# Altium project ECU V1.0 B.PrjPcb (part 8 of 9)

## Sheet 21_GPIOs_EXP.SchDoc
size A3; SheetNumber: 22; SheetTotal: 22
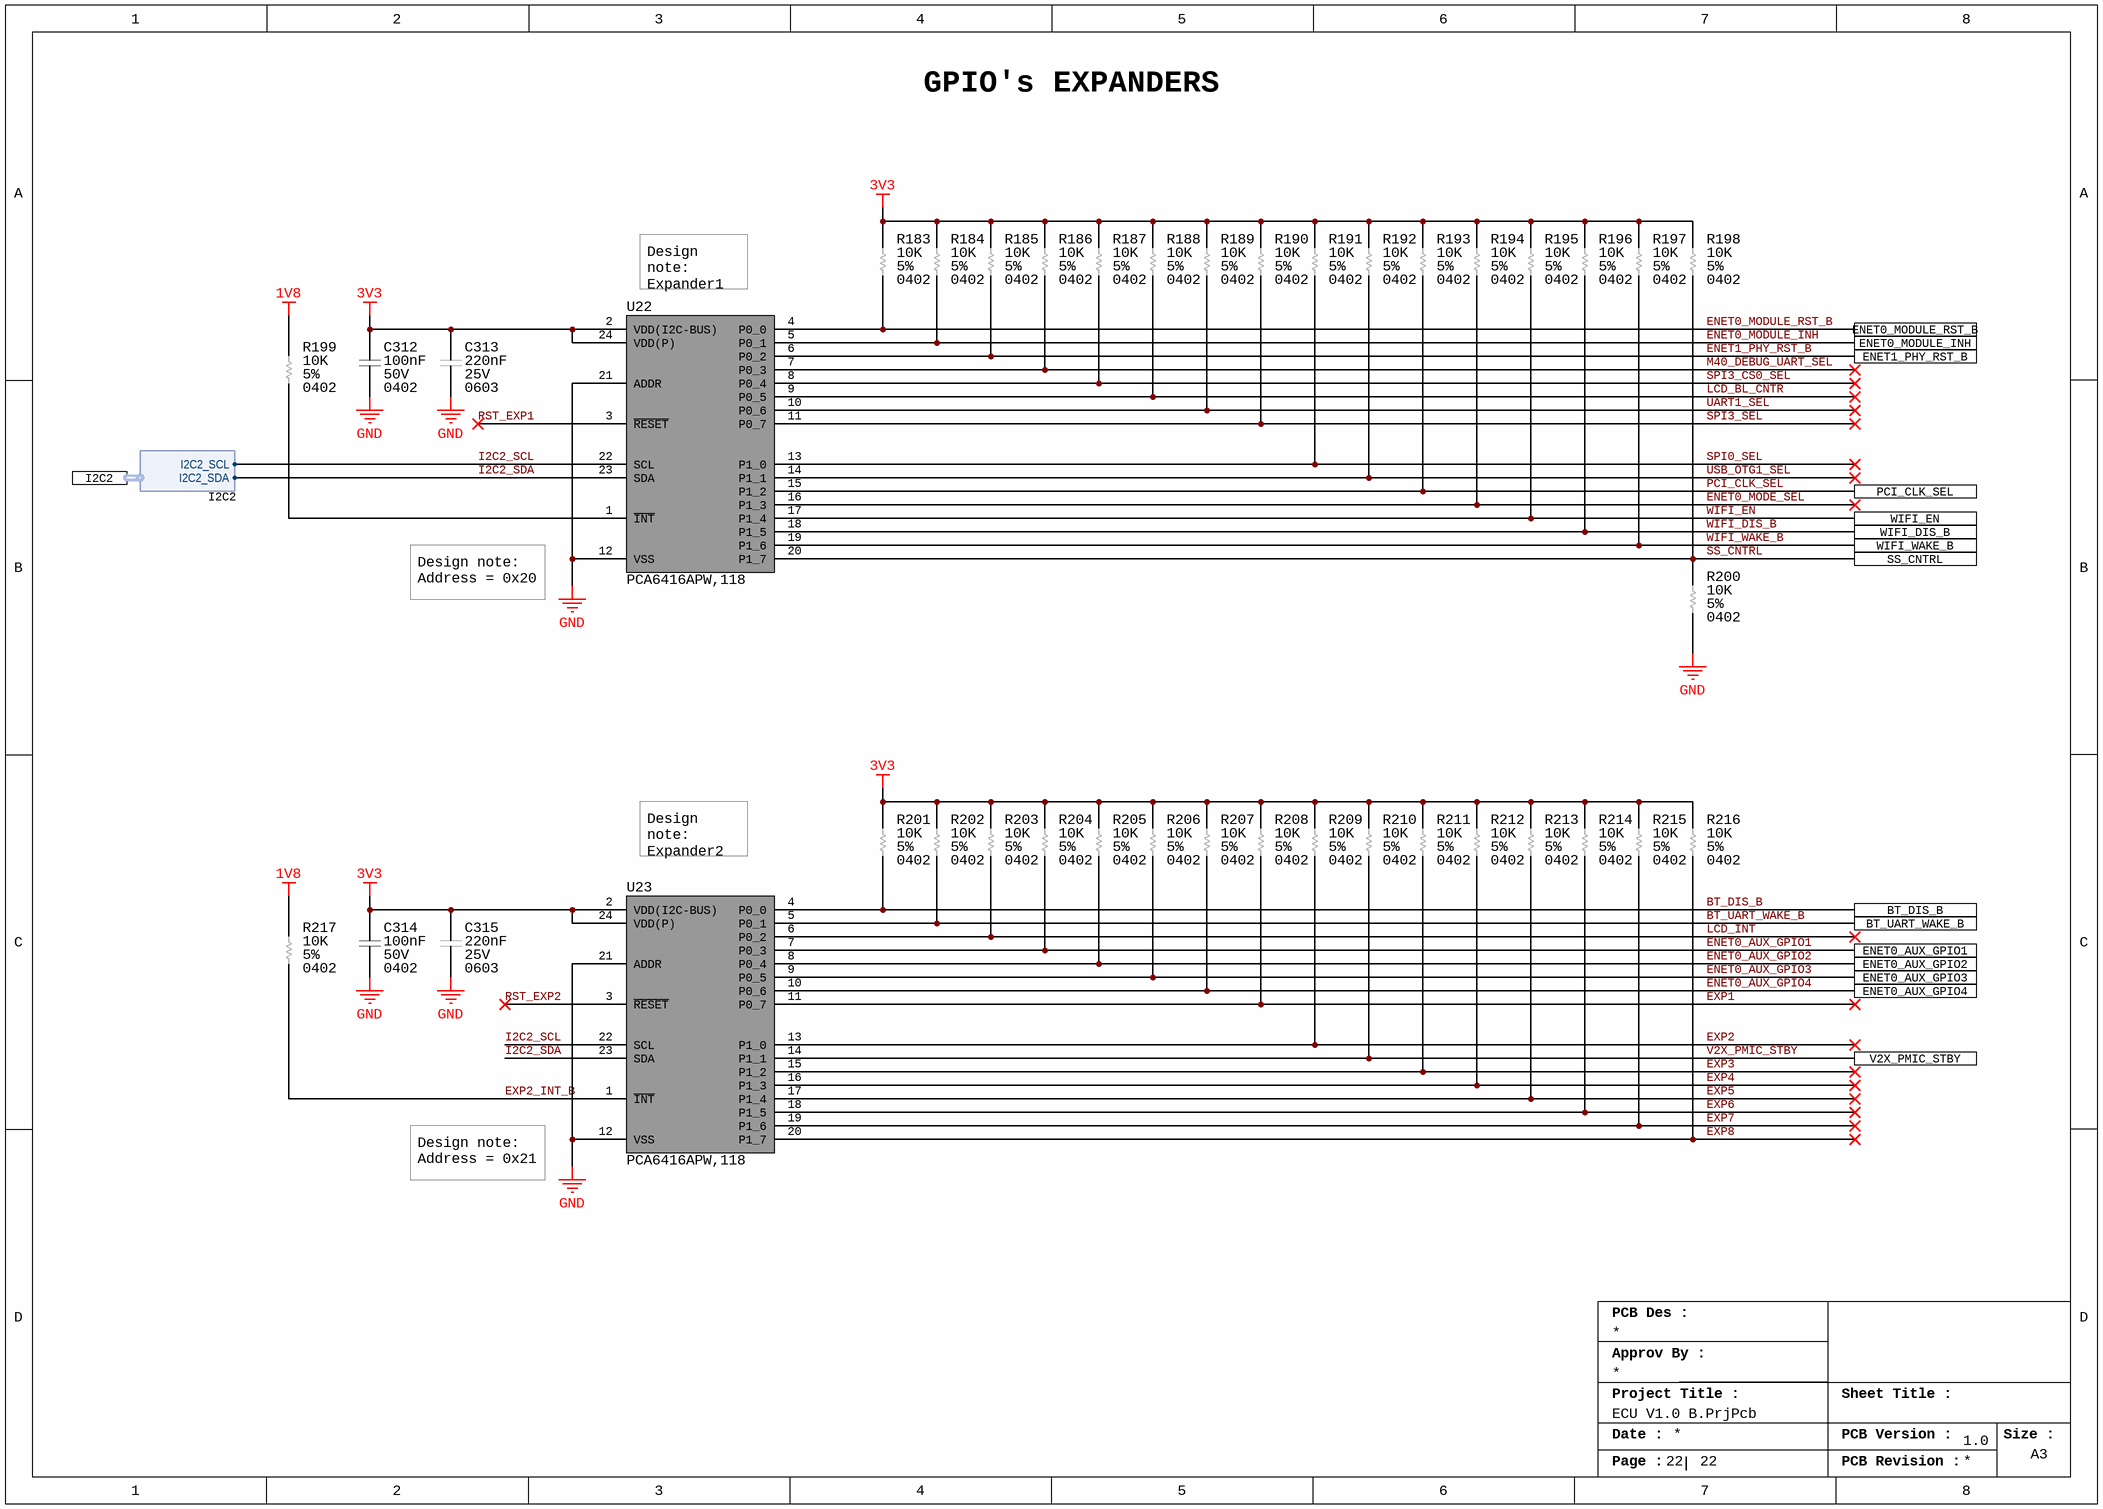
[diagram p11: 21_GPIOs_EXP.SchDoc]

### Parts
C312  Voltage Rating: 50V  Capacitance: 100nF  Case/Package: 0402  [CAP_0402_CAPC1005X05N]  (hidden comment: GRM155R71H104KE14D)
C313  Case/Package: 0603  Voltage Rating: 25V  Capacitance: 220nF  [CAP_0603_CAPC1608X08N]  (hidden comment: GRM188R71E224KA88D)
C314  Voltage Rating: 50V  Capacitance: 100nF  Case/Package: 0402  [CAP_0402_CAPC1005X05N]  (hidden comment: GRM155R71H104KE14D)
C315  Case/Package: 0603  Voltage Rating: 25V  Capacitance: 220nF  [CAP_0603_CAPC1608X08N]  (hidden comment: GRM188R71E224KA88D)
R183  Tolerance: 5%  Resistance: 10K  Case/Package: 0402  [RES_0402_RESC1005X04N]  (hidden comment: ERJ-2GEJ103X)
R184  Tolerance: 5%  Resistance: 10K  Case/Package: 0402  [RES_0402_RESC1005X04N]  (hidden comment: ERJ-2GEJ103X)
R185  Tolerance: 5%  Resistance: 10K  Case/Package: 0402  [RES_0402_RESC1005X04N]  (hidden comment: ERJ-2GEJ103X)
R186  Tolerance: 5%  Resistance: 10K  Case/Package: 0402  [RES_0402_RESC1005X04N]  (hidden comment: ERJ-2GEJ103X)
R187  Tolerance: 5%  Resistance: 10K  Case/Package: 0402  [RES_0402_RESC1005X04N]  (hidden comment: ERJ-2GEJ103X)
R188  Tolerance: 5%  Resistance: 10K  Case/Package: 0402  [RES_0402_RESC1005X04N]  (hidden comment: ERJ-2GEJ103X)
R189  Tolerance: 5%  Resistance: 10K  Case/Package: 0402  [RES_0402_RESC1005X04N]  (hidden comment: ERJ-2GEJ103X)
R190  Tolerance: 5%  Resistance: 10K  Case/Package: 0402  [RES_0402_RESC1005X04N]  (hidden comment: ERJ-2GEJ103X)
R191  Tolerance: 5%  Resistance: 10K  Case/Package: 0402  [RES_0402_RESC1005X04N]  (hidden comment: ERJ-2GEJ103X)
R192  Tolerance: 5%  Resistance: 10K  Case/Package: 0402  [RES_0402_RESC1005X04N]  (hidden comment: ERJ-2GEJ103X)
R193  Tolerance: 5%  Resistance: 10K  Case/Package: 0402  [RES_0402_RESC1005X04N]  (hidden comment: ERJ-2GEJ103X)
R194  Tolerance: 5%  Resistance: 10K  Case/Package: 0402  [RES_0402_RESC1005X04N]  (hidden comment: ERJ-2GEJ103X)
R195  Tolerance: 5%  Resistance: 10K  Case/Package: 0402  [RES_0402_RESC1005X04N]  (hidden comment: ERJ-2GEJ103X)
R196  Tolerance: 5%  Resistance: 10K  Case/Package: 0402  [RES_0402_RESC1005X04N]  (hidden comment: ERJ-2GEJ103X)
R197  Tolerance: 5%  Resistance: 10K  Case/Package: 0402  [RES_0402_RESC1005X04N]  (hidden comment: ERJ-2GEJ103X)
R198  Tolerance: 5%  Resistance: 10K  Case/Package: 0402  [RES_0402_RESC1005X04N]  (hidden comment: ERJ-2GEJ103X)
R199  Tolerance: 5%  Resistance: 10K  Case/Package: 0402  [RES_0402_RESC1005X04N]  (hidden comment: ERJ-2GEJ103X)
R200  Tolerance: 5%  Resistance: 10K  Case/Package: 0402  [RES_0402_RESC1005X04N]  (hidden comment: ERJ-2GEJ103X)
R201  Tolerance: 5%  Resistance: 10K  Case/Package: 0402  [RES_0402_RESC1005X04N]  (hidden comment: ERJ-2GEJ103X)
R202  Tolerance: 5%  Resistance: 10K  Case/Package: 0402  [RES_0402_RESC1005X04N]  (hidden comment: ERJ-2GEJ103X)
R203  Tolerance: 5%  Resistance: 10K  Case/Package: 0402  [RES_0402_RESC1005X04N]  (hidden comment: ERJ-2GEJ103X)
R204  Tolerance: 5%  Resistance: 10K  Case/Package: 0402  [RES_0402_RESC1005X04N]  (hidden comment: ERJ-2GEJ103X)
R205  Tolerance: 5%  Resistance: 10K  Case/Package: 0402  [RES_0402_RESC1005X04N]  (hidden comment: ERJ-2GEJ103X)
R206  Tolerance: 5%  Resistance: 10K  Case/Package: 0402  [RES_0402_RESC1005X04N]  (hidden comment: ERJ-2GEJ103X)
R207  Tolerance: 5%  Resistance: 10K  Case/Package: 0402  [RES_0402_RESC1005X04N]  (hidden comment: ERJ-2GEJ103X)
R208  Tolerance: 5%  Resistance: 10K  Case/Package: 0402  [RES_0402_RESC1005X04N]  (hidden comment: ERJ-2GEJ103X)
R209  Tolerance: 5%  Resistance: 10K  Case/Package: 0402  [RES_0402_RESC1005X04N]  (hidden comment: ERJ-2GEJ103X)
R210  Tolerance: 5%  Resistance: 10K  Case/Package: 0402  [RES_0402_RESC1005X04N]  (hidden comment: ERJ-2GEJ103X)
R211  Tolerance: 5%  Resistance: 10K  Case/Package: 0402  [RES_0402_RESC1005X04N]  (hidden comment: ERJ-2GEJ103X)
R212  Tolerance: 5%  Resistance: 10K  Case/Package: 0402  [RES_0402_RESC1005X04N]  (hidden comment: ERJ-2GEJ103X)
R213  Tolerance: 5%  Resistance: 10K  Case/Package: 0402  [RES_0402_RESC1005X04N]  (hidden comment: ERJ-2GEJ103X)
R214  Tolerance: 5%  Resistance: 10K  Case/Package: 0402  [RES_0402_RESC1005X04N]  (hidden comment: ERJ-2GEJ103X)
R215  Tolerance: 5%  Resistance: 10K  Case/Package: 0402  [RES_0402_RESC1005X04N]  (hidden comment: ERJ-2GEJ103X)
R216  Tolerance: 5%  Resistance: 10K  Case/Package: 0402  [RES_0402_RESC1005X04N]  (hidden comment: ERJ-2GEJ103X)
R217  Tolerance: 5%  Resistance: 10K  Case/Package: 0402  [RES_0402_RESC1005X04N]  (hidden comment: ERJ-2GEJ103X)
U22  PCA6416APW,118  [PCA6416APW118]
U23  PCA6416APW,118  [PCA6416APW118]

### Ports
BT_DIS_B, BT_UART_WAKE_B, ENET0_AUX_GPIO1, ENET0_AUX_GPIO2, ENET0_AUX_GPIO3, ENET0_AUX_GPIO4, ENET0_MODULE_INH, ENET0_MODULE_RST_B, ENET1_PHY_RST_B, I2C2 (harness I2C2), PCI_CLK_SEL, SS_CNTRL, V2X_PMIC_STBY, WIFI_DIS_B, WIFI_EN, WIFI_WAKE_B

### Harnesses
I2C2: I2C2_SDA, I2C2_SCL

### Nets
1V8: R199.2 R217.2
3V3: C312.2 C313.2 C314.2 C315.2 R183.2 R184.2 R185.2 R186.2 R187.2 R188.2 R189.2 R190.2 R191.2 R192.2 R193.2 R194.2 R195.2 R196.2 R197.2 R198.2 R201.2 R202.2 R203.2 R204.2 R205.2 R206.2 R207.2 R208.2 R209.2 R210.2 R211.2 R212.2 R213.2 R214.2 R215.2 R216.2 U22.2(VDD(I2C-BUS)) U22.24(VDD(P)) U23.2(VDD(I2C-BUS)) U23.24(VDD(P))
GND: C312.1 C313.1 C314.1 C315.1 R200.1 U22.12(VSS) U22.21(ADDR) U23.12(VSS) U23.21(ADDR)
BT_DIS_B: R201.1 U23.4(P0_0) ; port BT_DIS_B
BT_UART_WAKE_B: R202.1 U23.5(P0_1) ; port BT_UART_WAKE_B
ENET0_AUX_GPIO1: R204.1 U23.7(P0_3) ; port ENET0_AUX_GPIO1
ENET0_AUX_GPIO2: R205.1 U23.8(P0_4) ; port ENET0_AUX_GPIO2
ENET0_AUX_GPIO3: R206.1 U23.9(P0_5) ; port ENET0_AUX_GPIO3
ENET0_AUX_GPIO4: R207.1 U23.10(P0_6) ; port ENET0_AUX_GPIO4
ENET0_MODE_SEL: R194.1 U22.16(P1_3)
ENET0_MODULE_INH: R184.1 U22.5(P0_1) ; port ENET0_MODULE_INH
ENET0_MODULE_RST_B: R183.1 U22.4(P0_0) ; port ENET0_MODULE_RST_B
ENET1_PHY_RST_B: R185.1 U22.6(P0_2) ; port ENET1_PHY_RST_B
EXP1: R208.1 U23.11(P0_7)
EXP2: R209.1 U23.13(P1_0)
EXP2_INT_B: R217.1 U23.1(~{INT})
EXP3: R211.1 U23.15(P1_2)
EXP4: R212.1 U23.16(P1_3)
EXP5: R213.1 U23.17(P1_4)
EXP6: R214.1 U23.18(P1_5)
EXP7: R215.1 U23.19(P1_6)
EXP8: R216.1 U23.20(P1_7)
I2C2_SCL: U22.22(SCL) U23.22(SCL) ; port I2C2.I2C2_SCL
I2C2_SDA: U22.23(SDA) U23.23(SDA) ; port I2C2.I2C2_SDA
LCD_BL_CNTR: R188.1 U22.9(P0_5)
LCD_INT: R203.1 U23.6(P0_2)
M40_DEBUG_UART_SEL: R186.1 U22.7(P0_3)
PCI_CLK_SEL: R193.1 U22.15(P1_2) ; port PCI_CLK_SEL
RST_EXP1: U22.3(~{RESET})
RST_EXP2: U23.3(~{RESET})
SPI0_SEL: R191.1 U22.13(P1_0)
SPI3_CS0_SEL: R187.1 U22.8(P0_4)
SPI3_SEL: R190.1 U22.11(P0_7)
SS_CNTRL: R198.1 R200.2 U22.20(P1_7) ; port SS_CNTRL
UART1_SEL: R189.1 U22.10(P0_6)
USB_OTG1_SEL: R192.1 U22.14(P1_1)
V2X_PMIC_STBY: R210.1 U23.14(P1_1) ; port V2X_PMIC_STBY
WIFI_DIS_B: R196.1 U22.18(P1_5) ; port WIFI_DIS_B
WIFI_EN: R195.1 U22.17(P1_4) ; port WIFI_EN
WIFI_WAKE_B: R197.1 U22.19(P1_6) ; port WIFI_WAKE_B
NetR199_1: R199.1 U22.1(~{INT})

### Notes on the sheet
- GPIO's EXPANDERS
- (near U22) Design note:
  Expander1
- Design note:
  Address = 0x20
- Design note:
  Expander2
- Design note:
  Address = 0x21
- PCB Des :
- Approv By :
- Project Title :
- Sheet Title :
- Date :
- PCB Version :
- Size :
- A3
- Page :
- PCB Revision :

### Library data of the parts
C312 C314 = CAP_100NF_50V_X7R_0402: Multilayer Ceramic Capacitor, 0.1 uF, 16 V, ± 10%, X7R, 0402 [1005 Metric]; Manufacturer: Murata; Dissipation Factor: 0.025%; Temperature Coefficient: 30ppm/°C; Supplier 1: DigiKey; Manufacturer Part Number: GRM155R71H104KE14D; RoHS: Yes; Category: Ceramic Capacitors; Stock 1: 13730790; Pricing 1: 1=0.1, 10=0.023, 50=0.0132, 100=0.0102, 500=0.00768, 1000=0.00603, 2500=0.00548, 5000=0.00504 (USD); Mount: Surface Mount; Number of Pins: 2NUMBER; Case Code (Metric): 1005; Material: Ceramic; Case Code (Imperial): 0402; Weight: 0.000212oz; Dielectric Material: Ceramic; Min Operating Temperature: -55°C; Max Operating Temperature: 125°C; Packaging: Tape and Reel; Package Quantity: 10000; Series: GRM; Tolerance: 10%; Dielectric: X7R; Termination: SMD/SMT; Voltage: 50V; Voltage Rating (DC): 50V; Construction: Flat; Length: 1mm; Width: 0.5mm; Height: 0.5mm; Depth: 0.5mm; Thickness: 0.022inch; Reach SVHC Compliant: No; RoHS Compliant: Yes; Lead Free: 5697LeadFree; ComponentLink1URL: http://www.farnell.com/datasheets/2079156.pdf?src-supplier=Farnell; ComponentLink1Description: http://www.farnell.com/datasheets/2079156.pdf?src-supplier=Farnell; ComponentLink2URL: http://www.mouser.com/ds/2/281/c02e-2905.pdf?src-supplier=Mouser; ComponentLink2Description: http://www.mouser.com/ds/2/281/c02e-2905.pdf?src-supplier=Mouser; ComponentLink3URL: http://www.farnell.com/datasheets/2079156.pdf?src-supplier=Newark; ComponentLink3Description: http://www.farnell.com/datasheets/2079156.pdf?src-supplier=Newark; ComponentLink4URL: https://datasheet.octopart.com/GRM155R71H104KE14D-Murata-datasheet-22122223.pdf?src-supplier=Future+Electronics; ComponentLink4Description: https://datasheet.octopart.com/GRM155R71H104KE14D-Murata-datasheet-22122223.pdf?src-supplier=Future+Electronics; ComponentLink5URL: https://search.murata.co.jp/Ceramy/image/img/A01X/G101/ENG/GRM155R71H104KE14-01.pdf?src-supplier=Digi-Key; ComponentLink5Description: https://search.murata.co.jp/Ceramy/image/img/A01X/G101/ENG/GRM155R71H104KE14-01.pdf?src-supplier=Digi-Key; ComponentLink6URL: http://psearch.en.murata.com/capacitor/product/GRM155R71H104KE14%23.pdf?src-supplier=Avnet; ComponentLink6Description: http://psearch.en.murata.com/capacitor/product/GRM155R71H104KE14%23.pdf?src-supplier=Avnet; ComponentLink7URL: https://datasheet.octopart.com/GRM155R71H104KE14D-Murata-datasheet-66077078.pdf?src-supplier=Element14; ComponentLink7Description: https://datasheet.octopart.com/GRM155R71H104KE14D-Murata-datasheet-66077078.pdf?src-supplier=Element14; Supplier Part Number 1: 490-10700-6-ND; Supplier 2: Digikey; Stock 2: 3706055; Pricing 2: 1=0.1, 10=0.037, 50=0.021, 100=0.0162, 500=0.01224, 1000=0.00961, 2500=0.00874, 5000=0.00804 (USD); Halogen Free: 5694HalogenFree; ComponentLink8URL: http://www.mouser.com/ds/2/447/UPY-GPHC_X5R_4V-to-50V_25-1131599.pdf?src-supplier=Mouser; ComponentLink8Description: http://www.mouser.com/ds/2/447/UPY-GPHC_X5R_4V-to-50V_25-1131599.pdf?src-supplier=Mouser; ComponentLink9URL: https://datasheet.octopart.com/CC0402KRX5R8BB104-Yageo-datasheet-137700082.pdf?src-supplier=Future+Electronics; ComponentLink9Description: https://datasheet.octopart.com/CC0402KRX5R8BB104-Yageo-datasheet-137700082.pdf?src-supplier=Future+Electronics; ComponentLink10URL: http://www.yageo.com/documents/recent/UPY-GPHC_X5R_4V-to-50V_25.pdf?src-supplier=Digikey; ComponentLink10Description: http://www.yageo.com/documents/recent/UPY-GPHC_X5R_4V-to-50V_25.pdf?src-supplier=Digikey; ComponentLink11URL: https://datasheet.octopart.com/CC0402KRX5R8BB104-Yageo-datasheet-140260304.pdf?src-supplier=Newark; ComponentLink11Description: https://datasheet.octopart.com/CC0402KRX5R8BB104-Yageo-datasheet-140260304.pdf?src-supplier=Newark; ComponentLink12URL: https://datasheet.octopart.com/CC0402KRX5R8BB104-Yageo-datasheet-170350636.pdf?src-supplier=Future+Electronics; ComponentLink12Description: https://datasheet.octopart.com/CC0402KRX5R8BB104-Yageo-datasheet-170350636.pdf?src-supplier=Future+Electronics; ComponentLink13URL: http://www.yageo.com/documents/recent/UPY-GPHC_X5R_4V-to-50V-16.pdf?src-supplier=Future+Electronics; ComponentLink13Description: http://www.yageo.com/documents/recent/UPY-GPHC_X5R_4V-to-50V-16.pdf?src-supplier=Future+Electronics; Supplier Part Number 2: 311-1697-1-ND
C313 C315 = CAP_0.22uF_25V_X7R_0603: Multilayer Ceramic Capacitor, 0.22 uF, 25 V, ± 10%, X7R, 0603 [1608 Metric]; Manufacturer: Murata; Voltage: 50V; Supplier 1: Mouser; Manufacturer Part Number: GRM188R71E224KA88D; RoHS: Yes; Category: Ceramic Capacitors; Stock 1: 86605; Pricing 1: 1=0.1, 10=0.036, 50=0.036, 100=0.021, 1000=0.019, 10000=0.012 (USD); Mount: Surface Mount; Number of Pins: 2; Case Code (Imperial): 0603; Case Code (Metric): 1608; Material: Ceramic; Min Operating Temperature: -55°C; Max Operating Temperature: 125°C; Tolerance: 10%; Dielectric: X7R; Voltage Rating (DC): 25V; Packaging: Tape and Reel; Package Quantity: 1; Termination: SMD/SMT; Series: GRM; Construction: Flat; Length: 1.6mm; Width: 0.031inch; Height: 0.8mm; Thickness: 0.035inch; Depth: 0.8mm; Radiation Hardening: No; Reach SVHC Compliant: No; RoHS Compliant: Yes; Lead Free: 5697LeadFree; ComponentLink1URL: https://datasheet.ciiva.com/133/grm188r71e224ka88-01-133883.pdf?src-supplier=Digi-Key; ComponentLink1Description: https://datasheet.ciiva.com/133/grm188r71e224ka88-01-133883.pdf?src-supplier=Digi-Key; ComponentLink2URL: https://datasheet.ciiva.com/133/grm188r71e224ka88-01-133884.pdf?src-supplier=Digi-Key; ComponentLink2Description: https://datasheet.ciiva.com/133/grm188r71e224ka88-01-133884.pdf?src-supplier=Digi-Key; ComponentLink3URL: https://datasheet.ciiva.com/5411/product-5411362.pdf?src-supplier=Mouser; ComponentLink3Description: https://datasheet.ciiva.com/5411/product-5411362.pdf?src-supplier=Mouser; ComponentLink4URL: https://datasheet.ciiva.com/11786/0900766b807a1cab-11786308.pdf?src-supplier=Rs; ComponentLink4Description: https://datasheet.ciiva.com/11786/0900766b807a1cab-11786308.pdf?src-supplier=Rs; ComponentLink5URL: https://datasheet.ciiva.com/6068/1784408-6068393.pdf?src-supplier=Farnell; ComponentLink5Description: https://datasheet.ciiva.com/6068/1784408-6068393.pdf?src-supplier=Farnell; ComponentLink6URL: https://datasheet.ciiva.com/3777/1531grm188r71e224ka8823-3777688.pdf?src-supplier=Arrow+Electronics; ComponentLink6Description: https://datasheet.ciiva.com/3777/1531grm188r71e224ka8823-3777688.pdf?src-supplier=Arrow+Electronics; ComponentLink7URL: https://datasheet.ciiva.com/29202/451619-da-01-en-vs-kondensator-0603-29202002.pdf?src-supplier=Conrad; ComponentLink7Description: https://datasheet.ciiva.com/29202/451619-da-01-en-vs-kondensator-0603-29202002.pdf?src-supplier=Conrad; ComponentLink8URL: https://datasheet.ciiva.com/48436/nmgrm-data-en-48436687.pdf?src-supplier=Distrelec; ComponentLink8Description: https://datasheet.ciiva.com/48436/nmgrm-data-en-48436687.pdf?src-supplier=Distrelec; ComponentLink9URL: https://datasheet.ciiva.com/14116/nmgrm-data-en-14116629.pdf?src-supplier=Distrelec; ComponentLink9Description: https://datasheet.ciiva.com/14116/nmgrm-data-en-14116629.pdf?src-supplier=Distrelec; ComponentLink10URL: https://datasheet.ciiva.com/16425/product-16425866.pdf?src-supplier=Future+Electronics; ComponentLink10Description: https://datasheet.ciiva.com/16425/product-16425866.pdf?src-supplier=Future+Electronics; ComponentLink11URL: https://datasheet.ciiva.com/22703/1784408-22703338.pdf?src-supplier=Element14; ComponentLink11Description: https://datasheet.ciiva.com/22703/1784408-22703338.pdf?src-supplier=Element14; ComponentLink12URL: https://datasheet.ciiva.com/7937/1784408-7937645.pdf?src-supplier=Element14; ComponentLink12Description: https://datasheet.ciiva.com/7937/1784408-7937645.pdf?src-supplier=Element14; Supplier Part Number 1: 81-GRM188R71E224KA88
R183-R217 = RES_10K_5%_100mW_0402: Res Thick Film 0402 10K Ohm 5% 1/10W ±200ppm/°C Molded SMD Punched Carrier T/R; Manufacturer: Panasonic; Power Rating: 100mW; Voltage Rating: 50V; Supplier 1: Digi-Key; Manufacturer Part Number: ERJ-2GEJ103X; RoHS: Yes; Category: Chip SMD Resistors; Stock 1: 4696986; Pricing 1: 1=0.1, 10=0.021, 50=0.0132, 100=0.011, 500=0.00744, 1000=0.00639, 5000=0.00464 (USD); Mount: Surface Mount; Contact Plating: Tin; Case Code (Metric): 1005; Case Code (Imperial): 0402; Size Code: 0402; Min Operating Temperature: -55°C; Max Operating Temperature: 155°C; Temperature Coefficient: 200ppm/°C; Packaging: Cut Tape; Resistor Type: Thick Film; Package Quantity: 10000; Number of Terminations: 2; Termination: SMD/SMT; Max Power Dissipation: 100mW; Features: Automotive AEC-Q200; Series: ERJ; Resistance Tolerance: 5%; Technology: THICK FILM; Voltage Rating (DC): 50V; Length: 1mm; Width: 0.5mm; Height: 0.35mm; Depth: 0.5mm; Ratings: AEC-Q200; Radiation Hardening: No; Reach SVHC Compliant: No; RoHS Compliant: Yes; Lead Free: 5697LeadFree; ComponentLink1URL: https://datasheet.ciiva.com/27055/1935721-27055112.pdf?src-supplier=Jameco; ComponentLink1Description: https://datasheet.ciiva.com/27055/1935721-27055112.pdf?src-supplier=Jameco; ComponentLink2URL: https://datasheet.ciiva.com/11821/0900766b80f806dd-11821170.pdf?src-supplier=Rs; ComponentLink2Description: https://datasheet.ciiva.com/11821/0900766b80f806dd-11821170.pdf?src-supplier=Rs; ComponentLink3URL: https://datasheet.ciiva.com/43460/1678796-43460391.pdf?src-supplier=Farnell; ComponentLink3Description: https://datasheet.ciiva.com/43460/1678796-43460391.pdf?src-supplier=Farnell; ComponentLink4URL: https://datasheet.ciiva.com/22785/1678796-22785949.pdf?src-supplier=Farnell; ComponentLink4Description: https://datasheet.ciiva.com/22785/1678796-22785949.pdf?src-supplier=Farnell; ComponentLink5URL: https://datasheet.ciiva.com/46371/1678796-46371910.pdf?src-supplier=Element14; ComponentLink5Description: https://datasheet.ciiva.com/46371/1678796-46371910.pdf?src-supplier=Element14; ComponentLink6URL: https://datasheet.ciiva.com/28514/1678796-28514154.pdf?src-supplier=Element14; ComponentLink6Description: https://datasheet.ciiva.com/28514/1678796-28514154.pdf?src-supplier=Element14; ComponentLink7URL: https://datasheet.ciiva.com/24070/aoa0000ce1-37422-24070679.pdf?src-supplier=Mouser; ComponentLink7Description: https://datasheet.ciiva.com/24070/aoa0000ce1-37422-24070679.pdf?src-supplier=Mouser; ComponentLink8URL: https://datasheet.ciiva.com/16767/70260739-16767130.pdf?src-supplier=Allied+Electronics; ComponentLink8Description: https://datasheet.ciiva.com/16767/70260739-16767130.pdf?src-supplier=Allied+Electronics; ComponentLink9URL: https://datasheet.ciiva.com/16774/70260739-16774504.pdf?src-supplier=Allied+Electronics; ComponentLink9Description: https://datasheet.ciiva.com/16774/70260739-16774504.pdf?src-supplier=Allied+Electronics; ComponentLink10URL: https://datasheet.ciiva.com/9194/aoa0000ce1-9194140.pdf?src-supplier=Avnet; ComponentLink10Description: https://datasheet.ciiva.com/9194/aoa0000ce1-9194140.pdf?src-supplier=Avnet; Supplier Part Number 1: P10KJCT-ND
U22 U23 = IC_EXPANDER_16_PCA6416APW,118: I2C/SMBus Interface 100kHz/400kHz 5.5V 24-Pin TSSOP T/R; Manufacturer: NXP Semiconductors; Number of Channels: 1; Output Current: 10mA; Interface: I2C,SMBus; Operating Supply Current: 200mA; Max Frequency: 100kHz; Frequency: 400kHz; Number of I/Os: 16; Supplier 1: Verical; Manufacturer Part Number: PCA6416APW,118; RoHS: Yes; Category: Interface ICs; Stock 1: 2500; Pricing 1: 2500=0.7457, 5000=0.7272, 7500=0.7138, 12500=0.6896 (USD); Mount: Surface Mount; Case/Package: TSSOP; Number of Pins: 24; Weight: 0.007478oz; Min Operating Temperature: -40°C; Max Operating Temperature: 85°C; Operating Supply Voltage: 5.5V; Packaging: Tape and Reel; Package Quantity: 1; Series: -; Supply Voltage-Nom: 5.5V; Supply Current: 200mA; Lead Free: Lead Free; RoHS Compliant: Yes; ComponentLink1URL: https://datasheet.ciiva.com/12097/pca6416a-211613-12097269.pdf?src-supplier=Mouser; ComponentLink1Description: https://datasheet.ciiva.com/12097/pca6416a-211613-12097269.pdf?src-supplier=Mouser; ComponentLink2URL: https://datasheet.ciiva.com/16297/pca6416a-16297873.pdf?src-supplier=Future+Electronics; ComponentLink2Description: https://datasheet.ciiva.com/16297/pca6416a-16297873.pdf?src-supplier=Future+Electronics; ComponentLink3URL: https://datasheet.ciiva.com/6633/pca6416a-6633197.pdf?src-supplier=Digikey; ComponentLink3Description: https://datasheet.ciiva.com/6633/pca6416a-6633197.pdf?src-supplier=Digikey; ComponentLink4URL: https://datasheet.ciiva.com/6633/pca6416a-6633198.pdf?src-supplier=Digikey; ComponentLink4Description: https://datasheet.ciiva.com/6633/pca6416a-6633198.pdf?src-supplier=Digikey; ComponentLink5URL: https://datasheet.ciiva.com/6633/pca6416a-6633199.pdf?src-supplier=Digikey; ComponentLink5Description: https://datasheet.ciiva.com/6633/pca6416a-6633199.pdf?src-supplier=Digikey; Supplier Part Number 1: PCA6416APW,118

## Sheet 22_Nvidia_CAN.SchDoc
size A4; SheetNumber: 23; SheetTotal: 23
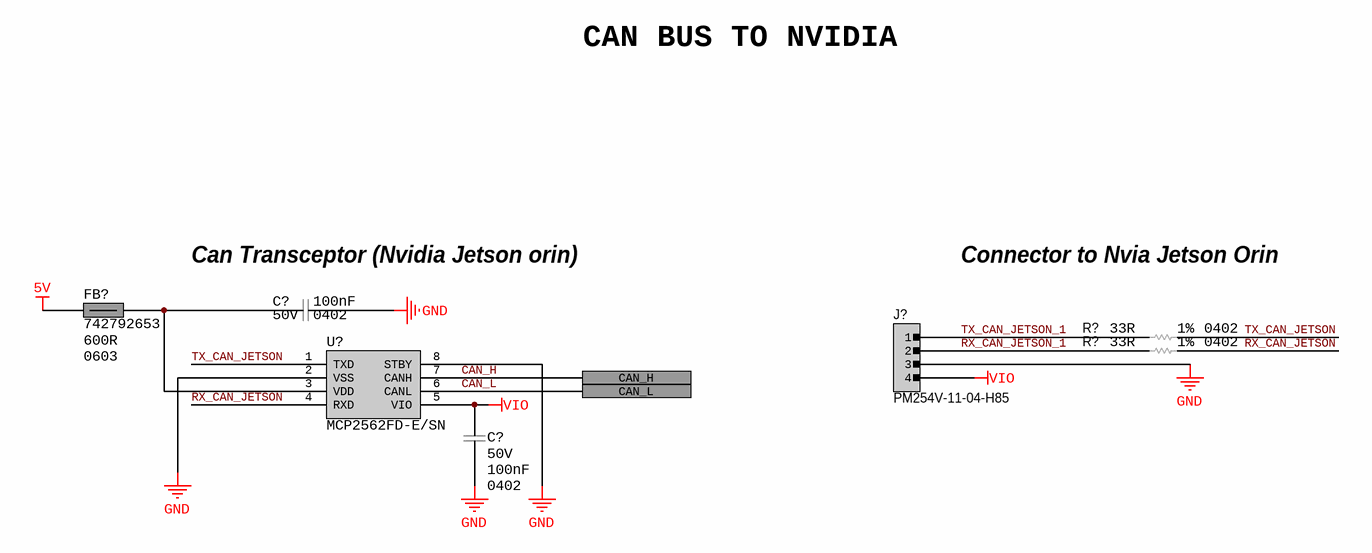
[diagram p12: 22_Nvidia_CAN.SchDoc]

### Parts
(Parts that share a designator on the sheet are numbered #1, #2 ... from top to bottom, then left to right.)
C?#1  Voltage Rating: 50V  Capacitance: 100nF  Case/Package: 0402  [CAP_0402_CAPC1005X05N]  (hidden comment: GRM155R71H104KE14D)
C?#2  Voltage Rating: 50V  Capacitance: 100nF  Case/Package: 0402  [CAP_0402_CAPC1005X05N]  (hidden comment: GRM155R71H104KE14D)
FB?#1  742792653  Impedance: 600R  Case Code (Imperial): 0603  [IND_0603_INDC1608X08N]
J?#1  PM254V-11-04-H85  [CONN_HEADER_FEM_4P]
R?#1  Tolerance: 1%  Resistance: 33R  Case/Package: 0402  [RES_0402_RESC1005X04N]  (hidden comment: RC0402FR-0733RL)
R?#2  Tolerance: 1%  Resistance: 33R  Case/Package: 0402  [RES_0402_RESC1005X04N]  (hidden comment: RC0402FR-0733RL)
U?#1  MCP2562FD-E/SN  [SOIC127P600X175-8N]

### Ports
CAN_H, CAN_L

### Nets
5V: FB?#1.1
GND: C?#1.2 C?#2.2 J?#1.3 U?#1.2(VSS) U?#1.8(STBY)
VIO: C?#2.1 J?#1.4 U?#1.5(VIO)
CAN_H: U?#1.7(CANH) ; port CAN_H
CAN_L: U?#1.6(CANL) ; port CAN_L
RX_CAN_JETSON: R?#2.2 U?#1.4(RXD)
RX_CAN_JETSON_1: J?#1.2 R?#2.1
TX_CAN_JETSON: R?#1.2 U?#1.1(TXD)
TX_CAN_JETSON_1: J?#1.1 R?#1.1
NetC?#1_1: C?#1.1 FB?#1.2 U?#1.3(VDD)

### Notes on the sheet
- CAN BUS TO NVIDIA
- (near C?#1) Can Transceptor (Nvidia Jetson orin)
- Connector to Nvia Jetson Orin
- PCB Des :
- Approv By :
- Project Title :
- Sheet Title :
- Date :
- PCB Version :
- Size :
- A4
- Page :
- PCB Revision :

### Library data of the parts
C?#1 C?#2 = CAP_100NF_50V_X7R_0402: as C312 on sheet 21_GPIOs_EXP; Supplier 1: DigiKey; Manufacturer Part Number: GRM155R71H104KE14D; RoHS: Yes; Category: Ceramic Capacitors; Stock 1: 13730790; Pricing 1: 1=0.1, 10=0.023, 50=0.0132, 100=0.0102, 500=0.00768, 1000=0.00603, 2500=0.00548, 5000=0.00504 (USD); Mount: Surface Mount; Number of Pins: 2NUMBER; Case Code (Metric): 1005; Material: Ceramic; Case Code (Imperial): 0402; Weight: 0.000212oz; Dielectric Material: Ceramic; Min Operating Temperature: -55°C; Max Operating Temperature: 125°C; Packaging: Tape and Reel; Package Quantity: 10000; Series: GRM; Tolerance: 10%; Dielectric: X7R; Termination: SMD/SMT; Voltage: 50V; Voltage Rating (DC): 50V; Construction: Flat; Length: 1mm; Width: 0.5mm; Height: 0.5mm; Depth: 0.5mm; Thickness: 0.022inch; Reach SVHC Compliant: No; RoHS Compliant: Yes; Lead Free: 5697LeadFree; ComponentLink1URL: http://www.farnell.com/datasheets/2079156.pdf?src-supplier=Farnell; ComponentLink1Description: http://www.farnell.com/datasheets/2079156.pdf?src-supplier=Farnell; ComponentLink2URL: http://www.mouser.com/ds/2/281/c02e-2905.pdf?src-supplier=Mouser; ComponentLink2Description: http://www.mouser.com/ds/2/281/c02e-2905.pdf?src-supplier=Mouser; ComponentLink3URL: http://www.farnell.com/datasheets/2079156.pdf?src-supplier=Newark; ComponentLink3Description: http://www.farnell.com/datasheets/2079156.pdf?src-supplier=Newark; ComponentLink4URL: https://datasheet.octopart.com/GRM155R71H104KE14D-Murata-datasheet-22122223.pdf?src-supplier=Future+Electronics; ComponentLink4Description: https://datasheet.octopart.com/GRM155R71H104KE14D-Murata-datasheet-22122223.pdf?src-supplier=Future+Electronics; ComponentLink5URL: https://search.murata.co.jp/Ceramy/image/img/A01X/G101/ENG/GRM155R71H104KE14-01.pdf?src-supplier=Digi-Key; ComponentLink5Description: https://search.murata.co.jp/Ceramy/image/img/A01X/G101/ENG/GRM155R71H104KE14-01.pdf?src-supplier=Digi-Key; ComponentLink6URL: http://psearch.en.murata.com/capacitor/product/GRM155R71H104KE14%23.pdf?src-supplier=Avnet; ComponentLink6Description: http://psearch.en.murata.com/capacitor/product/GRM155R71H104KE14%23.pdf?src-supplier=Avnet; ComponentLink7URL: https://datasheet.octopart.com/GRM155R71H104KE14D-Murata-datasheet-66077078.pdf?src-supplier=Element14; ComponentLink7Description: https://datasheet.octopart.com/GRM155R71H104KE14D-Murata-datasheet-66077078.pdf?src-supplier=Element14; Supplier Part Number 1: 490-10700-6-ND; Supplier 2: Digikey; Stock 2: 3706055; Pricing 2: 1=0.1, 10=0.037, 50=0.021, 100=0.0162, 500=0.01224, 1000=0.00961, 2500=0.00874, 5000=0.00804 (USD); Halogen Free: 5694HalogenFree; ComponentLink8URL: http://www.mouser.com/ds/2/447/UPY-GPHC_X5R_4V-to-50V_25-1131599.pdf?src-supplier=Mouser; ComponentLink8Description: http://www.mouser.com/ds/2/447/UPY-GPHC_X5R_4V-to-50V_25-1131599.pdf?src-supplier=Mouser; ComponentLink9URL: https://datasheet.octopart.com/CC0402KRX5R8BB104-Yageo-datasheet-137700082.pdf?src-supplier=Future+Electronics; ComponentLink9Description: https://datasheet.octopart.com/CC0402KRX5R8BB104-Yageo-datasheet-137700082.pdf?src-supplier=Future+Electronics; ComponentLink10URL: http://www.yageo.com/documents/recent/UPY-GPHC_X5R_4V-to-50V_25.pdf?src-supplier=Digikey; ComponentLink10Description: http://www.yageo.com/documents/recent/UPY-GPHC_X5R_4V-to-50V_25.pdf?src-supplier=Digikey; ComponentLink11URL: https://datasheet.octopart.com/CC0402KRX5R8BB104-Yageo-datasheet-140260304.pdf?src-supplier=Newark; ComponentLink11Description: https://datasheet.octopart.com/CC0402KRX5R8BB104-Yageo-datasheet-140260304.pdf?src-supplier=Newark; ComponentLink12URL: https://datasheet.octopart.com/CC0402KRX5R8BB104-Yageo-datasheet-170350636.pdf?src-supplier=Future+Electronics; ComponentLink12Description: https://datasheet.octopart.com/CC0402KRX5R8BB104-Yageo-datasheet-170350636.pdf?src-supplier=Future+Electronics; ComponentLink13URL: http://www.yageo.com/documents/recent/UPY-GPHC_X5R_4V-to-50V-16.pdf?src-supplier=Future+Electronics; ComponentLink13Description: http://www.yageo.com/documents/recent/UPY-GPHC_X5R_4V-to-50V-16.pdf?src-supplier=Future+Electronics; Supplier Part Number 2: 311-1697-1-ND
FB?#1 = IND_FERRITE_BEADS_600R_300mA_0603_742792653: WE-CBF Ferrite Bead 0603 600Ohm 300mA | Wurth Elektronik 742792653; Manufacturer: Wurth Electronics; Tolerance: 25%; Number of Lines: 1; Inductance: 2.4nH; Test Frequency: 200MHz; Supplier 1: Digikey; Manufacturer Part Number: 742792653; RoHS: Yes; Category: Ferrite Beads and Chips; Stock 1: 14278; Pricing 1: 1=0.16, 50=0.1612, 100=0.1485, 500=0.1422, 1000=0.135, 2000=0.1287 (USD); Mount: Surface Mount; Case/Package: SMD/SMT; Core Material: Ferrite; Case Code (Metric): 1608; Weight: 7.1E-05oz; Material: Ferrite; Min Operating Temperature: -55°C; Max Operating Temperature: 125°C; Packaging: Tape and Reel; Package Quantity: 1; Max Current Rating: 300mA; Max DC Current: 300mA; Termination: SMD/SMT; Series: WE-CBF; Length: 1.6mm; Width: 0.8mm; Height: 0.8mm; Depth: 0.8mm; Lead Free: Lead Free; RoHS Compliant: Yes; Reach SVHC Compliant: Unknown; ComponentLink1URL: https://datasheet.ciiva.com/29364/742792653-29364337.pdf?src-supplier=Digikey; ComponentLink1Description: https://datasheet.ciiva.com/29364/742792653-29364337.pdf?src-supplier=Digikey; ComponentLink2URL: https://datasheet.ciiva.com/1475/1696030-1475350.pdf?src-supplier=Farnell; ComponentLink2Description: https://datasheet.ciiva.com/1475/1696030-1475350.pdf?src-supplier=Farnell; ComponentLink3URL: https://datasheet.ciiva.com/11799/0900766b80d2e07a-11799236.pdf?src-supplier=Rs; ComponentLink3Description: https://datasheet.ciiva.com/11799/0900766b80d2e07a-11799236.pdf?src-supplier=Rs; ComponentLink4URL: https://datasheet.ciiva.com/1466/1696030-1466507.pdf?src-supplier=Element14; ComponentLink4Description: https://datasheet.ciiva.com/1466/1696030-1466507.pdf?src-supplier=Element14; ComponentLink5URL: https://datasheet.ciiva.com/14122/742792653-eng-tds-14122813.pdf?src-supplier=Distrelec; ComponentLink5Description: https://datasheet.ciiva.com/14122/742792653-eng-tds-14122813.pdf?src-supplier=Distrelec; Supplier Part Number 1: 732-4668-1-ND; Current Rating: 300mA
J?#1 = CONN_HEADER_FEMALE_4P_2.54mm_JLCPCB: 2.54mm Plugin 4P Brass Straight 1x4P Plugin,P=2.54mm  Female Headers ROHS; Manufacturer: XFCN; Number of Positions: 4; Connector Type: Header; Voltage Rating: 250V; Supplier: Jlcpcb; Manufacturer Part Number: PM254V-11-04-H85; RoHS: Yes; Category: Connectors; Mount: Through Hole; Contact Material: Bronze; Housing Material: Plastic; Contact Finish - Mating: TIN; Insulation Color: Black; Insulation Material: Polyester; Contact Shape: Square; Min Operating Temperature: -40°C; Max Operating Temperature: 105°C; Number of Rows: 1; Packaging: Tray; Termination: Solder; Contact Type: Female Socket; Fastening Type: Pull; Series: -; Length: 10.7mm; Width: 2.5mm; Height: 8.5mm; Pitch: 2.54mm; Lead Free: Lead Free; RoHS Compliant: Yes; Flammability Rating: UL94 V-0; JLCPCB Part Number: C541851
R?#1 R?#2 = RES_33R_1%_62.5mW_0402: SMD Chip Resistor, 33 Ohm, ± 1%, 62.5 mW, 0402 [1005 Metric], Thick Film, General Purpose; Manufacturer: Yageo; Power Rating: 62.5mW; Voltage Rating: 50V; Temperature Coefficient: 100ppm/°C; Max Power Dissipation: 63mW; Supplier 1: Digikey; Manufacturer Part Number: RC0402FR-0733RL; RoHS: Yes; Category: Chip SMD Resistors; Stock 1: 4637808; Pricing 1: 1=0.1, 10=0.015, 50=0.0088, 100=0.0073, 500=0.00488, 1000=0.00417, 5000=0.00297, 10000=0.00261, 20000=0.00231, 30000=0.00216, 50000=0.00199, 100000=0.00179 (USD); Number of Pins: 2; Case Code (Imperial): 0402; Case Code (Metric): 1005; Size Code: 0402; Min Operating Temperature: -55°C; Max Operating Temperature: 155°C; Packaging: Tape and Reel; Voltage Rating (DC): 50V; Package Quantity: 10000; Termination: SMD/SMT; Resistor Type: Thick Film; Features: Moisture Resistant; Series: RC; Number of Terminations: 2; Resistance Tolerance: 1%; Construction: Rectangular; Technology: THICK FILM; Voltage Rating (AC): 50V; Length: 1mm; Width: 0.5mm; Height: 0.35mm; Depth: 0.5mm; Military Standard: Not; Lead Free: Lead Free; RoHS Compliant: Yes; Reach SVHC Compliant: Unknown; ComponentLink1URL: https://datasheet.ciiva.com/11819/0900766b80c66297-11819487.pdf?src-supplier=Rs; ComponentLink1Description: https://datasheet.ciiva.com/11819/0900766b80c66297-11819487.pdf?src-supplier=Rs; ComponentLink2URL: https://datasheet.ciiva.com/7849/1018594-7849966.pdf?src-supplier=Element14; ComponentLink2Description: https://datasheet.ciiva.com/7849/1018594-7849966.pdf?src-supplier=Element14; ComponentLink3URL: https://datasheet.ciiva.com/7849/1018594-7849967.pdf?src-supplier=Element14; ComponentLink3Description: https://datasheet.ciiva.com/7849/1018594-7849967.pdf?src-supplier=Element14; ComponentLink4URL: https://datasheet.ciiva.com/24070/pyu-rc0402-51-rohs-l-6-r-8721-24070077.pdf?src-supplier=Mouser; ComponentLink4Description: https://datasheet.ciiva.com/24070/pyu-rc0402-51-rohs-l-6-r-8721-24070077.pdf?src-supplier=Mouser; Supplier Part Number 1: 311-33.0LRCT-ND
U?#1 = IC_TRANSCEIVER_CAN_MCP2562FD-E/SN: MCP2562 Series 5 V Surface Mount High-Speed CAN Transceiver - SOIC-8; Manufacturer: Microchip; Number of Receivers: 1; Data Rate: 8Mbps; Min Supply Voltage: 4.5V; Max Supply Voltage: 5.5V; Max Supply Current: 70mA; Propagation Delay: 120ns; Receiver Hysteresis: 200mV; Operating Supply Voltage: 5V; Supplier 1: Digikey; Manufacturer Part Number: MCP2562FD-E/SN; RoHS: Yes; Category: Interface ICs; Stock 1: 36654; Pricing 1: 100=0.98 (USD); Mount: Surface Mount; Case/Package: SOIC; Number of Pins: 8; Weight: 0.019048oz; Min Operating Temperature: -40°C; Max Operating Temperature: 125°C; Packaging: Rail/Tube; Number of Transceivers: 1; Interface: CAN; Number of Drivers: 1; Number of Transmit Buffers: 1; Number of Receive Buffers: 1; Operating Supply Current: 70mA; Package Quantity: 100; Series: -; Length: 4.9mm; Width: 3.9mm; Height: 1.5mm; Reach SVHC Compliant: No; Lead Free: Lead Free; RoHS Compliant: Yes; ComponentLink1URL: https://datasheet.ciiva.com/48473/20005284a-48473180.pdf?src-supplier=Avnet; ComponentLink1Description: https://datasheet.ciiva.com/48473/20005284a-48473180.pdf?src-supplier=Avnet; ComponentLink2URL: https://datasheet.ciiva.com/48512/mcp2562fd-e-mf-eng-tds-48512074.pdf?src-supplier=Distrelec; ComponentLink2Description: https://datasheet.ciiva.com/48512/mcp2562fd-e-mf-eng-tds-48512074.pdf?src-supplier=Distrelec; ComponentLink3URL: https://datasheet.ciiva.com/46406/1821190-46406053.pdf?src-supplier=Element14; ComponentLink3Description: https://datasheet.ciiva.com/46406/1821190-46406053.pdf?src-supplier=Element14; ComponentLink4URL: https://datasheet.ciiva.com/46406/1821190-46406061.pdf?src-supplier=Element14; ComponentLink4Description: https://datasheet.ciiva.com/46406/1821190-46406061.pdf?src-supplier=Element14; Supplier Part Number 1: MCP2562FD-E/SN-ND

## Sheet 23_IMU_GPS.SchDoc
size A3; SheetNumber: 24; SheetTotal: 24
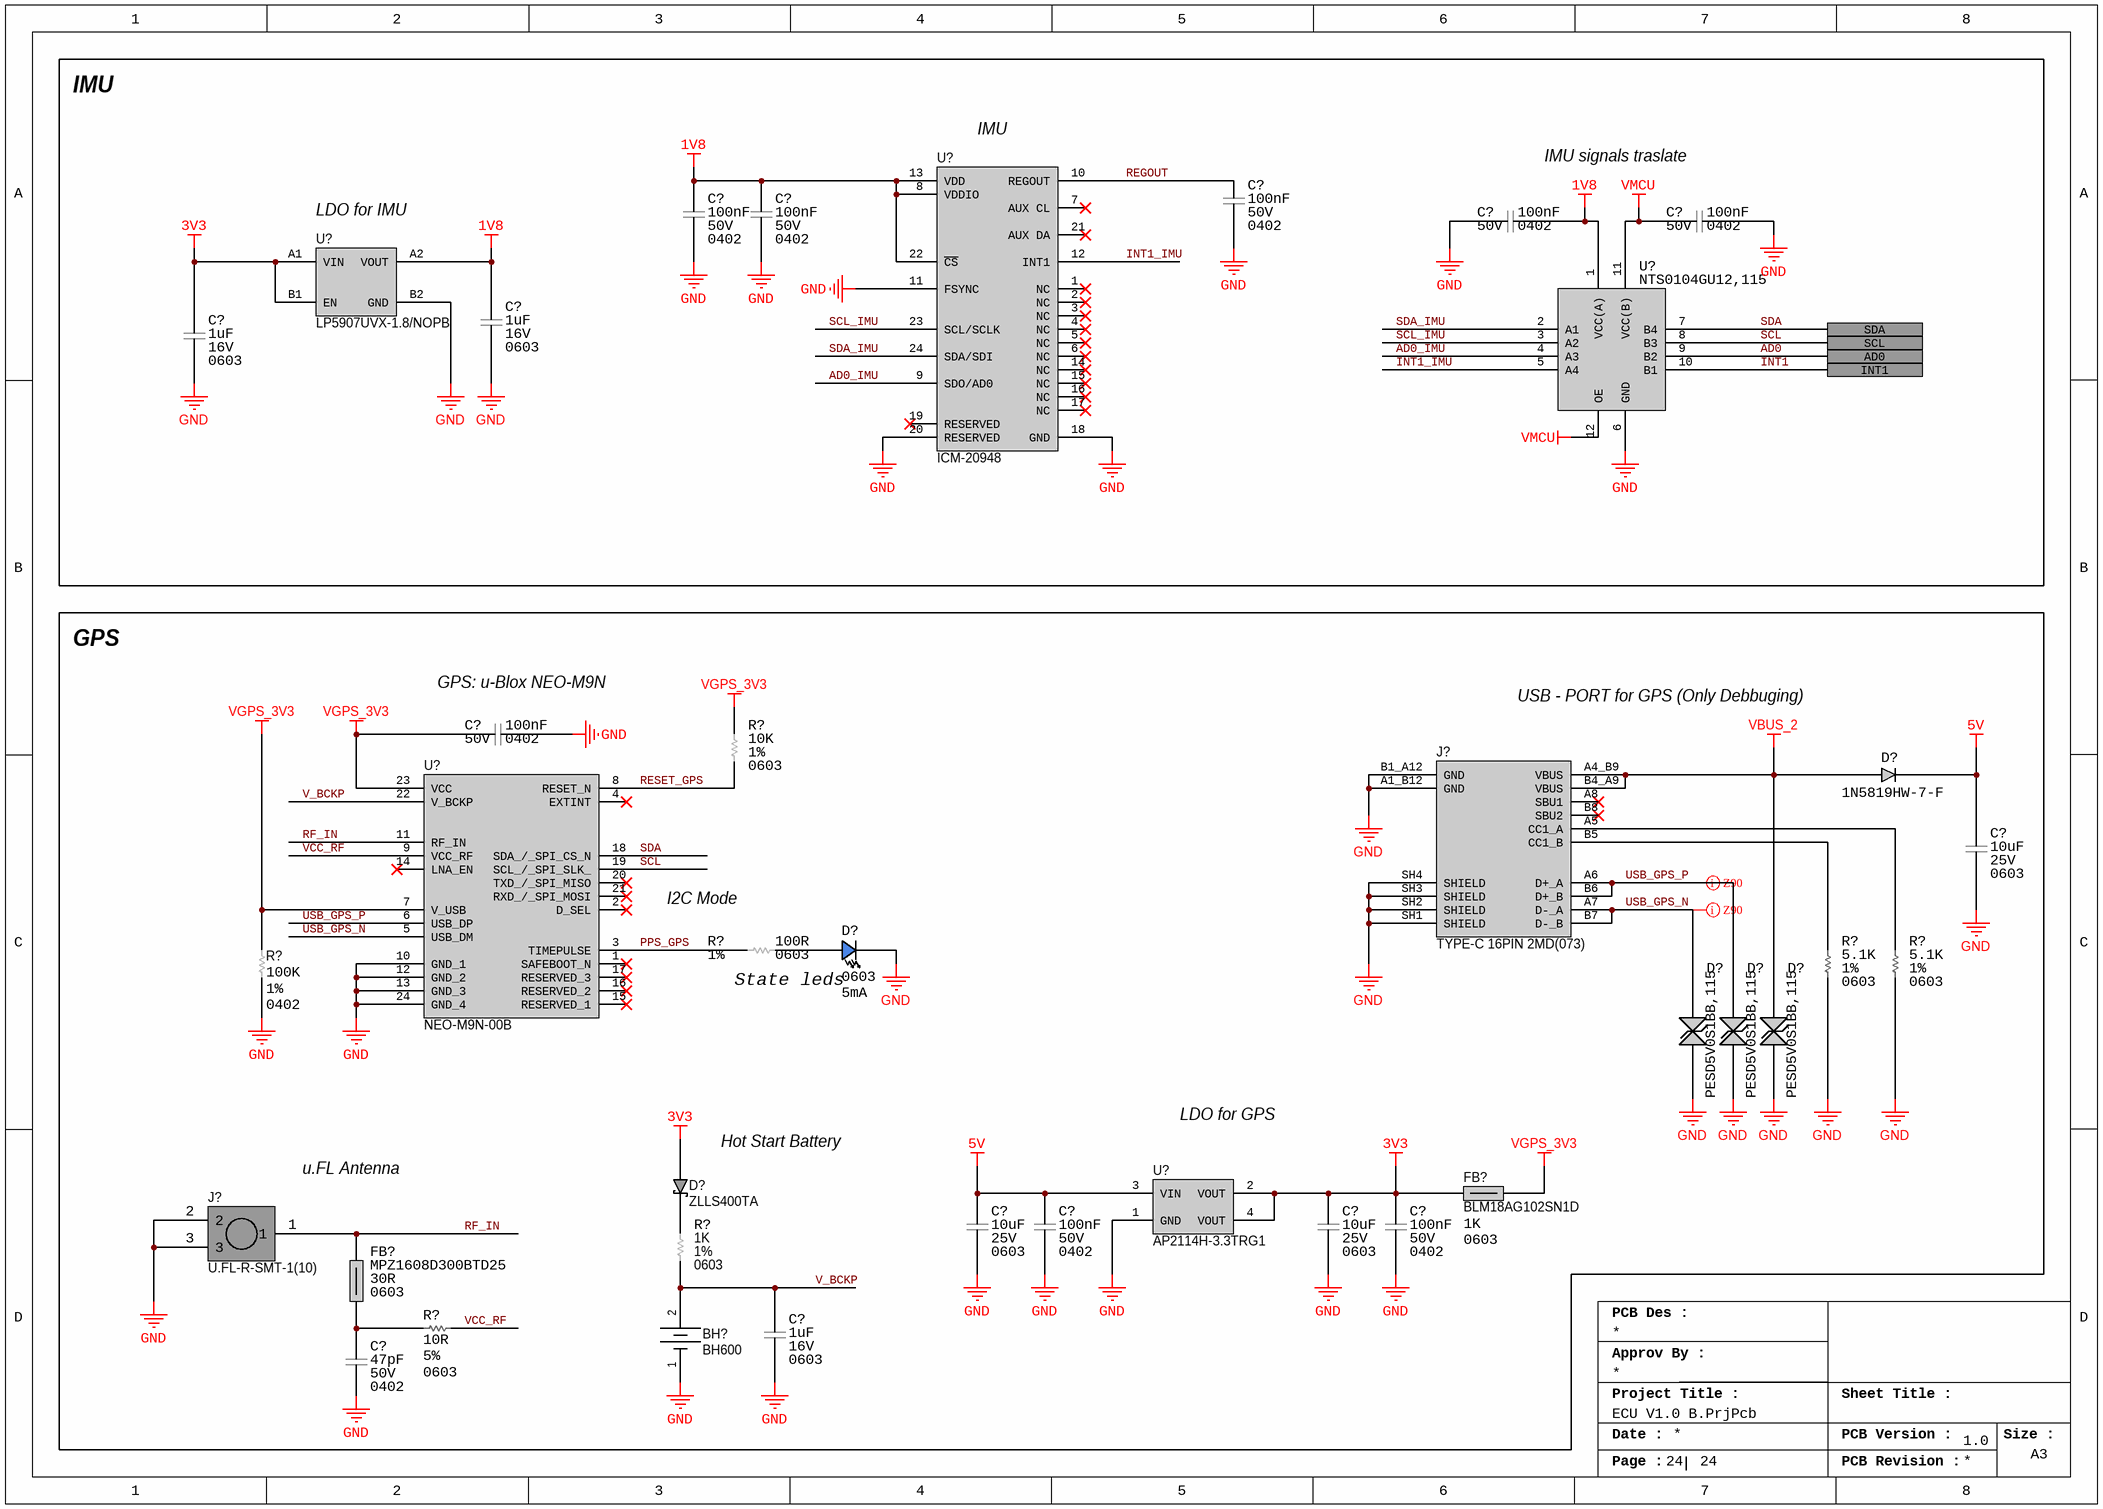
[diagram p13: 23_IMU_GPS.SchDoc]

### Parts
(Parts that share a designator on the sheet are numbered #1, #2 ... from top to bottom, then left to right.)
BH?  BH600  [MECH_BATTERY_HOLDER_BH600]
C?#3  Voltage Rating: 50V  Capacitance: 100nF  Case/Package: 0402  [CAP_0402_CAPC1005X05N]  (hidden comment: GRM155R71H104KE14D)
C?#4  Voltage Rating: 50V  Capacitance: 100nF  Case/Package: 0402  [CAP_0402_CAPC1005X05N]  (hidden comment: GRM155R71H104KE14D)
C?#5  Voltage Rating: 50V  Capacitance: 100nF  Case/Package: 0402  [CAP_0402_CAPC1005X05N]  (hidden comment: GRM155R71H104KE14D)
C?#6  Voltage Rating: 50V  Capacitance: 100nF  Case/Package: 0402  [CAP_0402_CAPC1005X05N]  (hidden comment: GRM155R71H104KE14D)
C?#7  Voltage Rating: 50V  Capacitance: 100nF  Case/Package: 0402  [CAP_0402_CAPC1005X05N]  (hidden comment: GRM155R71H104KE14D)
C?#8  Voltage Rating: 16V  Capacitance: 1uF  Case/Package: 0603  [CAP_0603_CAPC1608X08N]  (hidden comment: CL10A105KO8NNNC)
C?#9  Voltage Rating: 16V  Capacitance: 1uF  Case/Package: 0603  [CAP_0603_CAPC1608X08N]  (hidden comment: CL10A105KO8NNNC)
C?#10  Voltage Rating: 50V  Capacitance: 100nF  Case/Package: 0402  [CAP_0402_CAPC1005X05N]  (hidden comment: GRM155R71H104KE14D)
C?#11  Case/Package: 0603  Capacitance: 10uF  Voltage Rating: 25V  [CAP_0603_CAPC1608X08N]  (hidden comment: GRM188R61E106MA73D)
C?#12  Case/Package: 0603  Capacitance: 10uF  Voltage Rating: 25V  [CAP_0603_CAPC1608X08N]  (hidden comment: GRM188R61E106MA73D)
C?#13  Voltage Rating: 50V  Capacitance: 100nF  Case/Package: 0402  [CAP_0402_CAPC1005X05N]  (hidden comment: GRM155R71H104KE14D)
C?#14  Case/Package: 0603  Capacitance: 10uF  Voltage Rating: 25V  [CAP_0603_CAPC1608X08N]  (hidden comment: GRM188R61E106MA73D)
C?#15  Voltage Rating: 50V  Capacitance: 100nF  Case/Package: 0402  [CAP_0402_CAPC1005X05N]  (hidden comment: GRM155R71H104KE14D)
C?#16  Voltage Rating: 16V  Capacitance: 1uF  Case/Package: 0603  [CAP_0603_CAPC1608X08N]  (hidden comment: CL10A105KO8NNNC)
C?#17  Voltage Rating: 50V  Case/Package: 0402  Capacitance: 47pF  [CAP_0402_CAPC1005X05N]  (hidden comment: GCQ1555C1H470JB01D)
D?#1  1N5819HW-7-F  [DIO_SOD3716X145N]
D?#2  Case Code (Imperial): 0603  Test Current: 5mA  [LED_0603-BLUE-0.75mm]  (hidden comment: LTST-C193TBKT-5A)
D?#3  PESD5V0S1BB,115  [DIO_TVS_SODFL1608X65N]
D?#4  PESD5V0S1BB,115  [DIO_TVS_SODFL1608X65N]
D?#5  PESD5V0S1BB,115  [DIO_TVS_SODFL1608X65N]
D?#6  ZLLS400TA  [DIO_SOD2512X113N]
FB?#2  BLM18AG102SN1D  Impedance: 1K  Case/Package: 0603  [IND_0603_INDC1608X08N]
FB?#3  MPZ1608D300BTD25  Impedance: 30R  Case/Package: 0603  [IND_0603_INDC1608X08N]
J?#2  TYPE-C 16PIN 2MD(073)  [CONN_USB_C_16P]
J?#3  U.FL-R-SMT-1(10)  [CONN_UFL_U.FL-R-SMT-1(10)]
R?#3  Resistance: 10K  Tolerance: 1%  Case/Package: 0603  [RES_0603_RESC1608X04N]  (hidden comment: AC0603FR-1010KL)
R?#4  Case Code (Imperial): 0603  Tolerance: 1%  Resistance: 100R  [CAP_0603_CAPC1608X08N]  (hidden comment: ERJ3EKF1000V)
R?#5  Resistance: 100K  Tolerance: 1%  Case/Package: 0402  [RES_0402_RESC1005X04N]  (hidden comment: RC0402FR-07100KL)
R?#6  Tolerance: 1%  Resistance: 5.1K  Case/Package: 0603  [RES_0603_RESC1608X04N]  (hidden comment: RC0603FR-075K1L)
R?#7  Tolerance: 1%  Resistance: 5.1K  Case/Package: 0603  [RES_0603_RESC1608X04N]  (hidden comment: RC0603FR-075K1L)
R?#8  Resistance: 1K  Tolerance: 1%  Case/Package: 0603  [RES_0603_RESC1608X04N]  (hidden comment: AC0603FR-101KL)
R?#9  Resistance: 10R  Tolerance: 5%  Case/Package: 0603  [RES_0603_RESC1608X04N]  (hidden comment: RC0603JR-0710RL)
U?#2  LP5907UVX-1.8/NOPB  [IC_REG_LDO_BGA4C35P2X2_71X71X40]
U?#3  NTS0104GU12,115  [IC_LEVEL_TRASLATOR_XQFN12_0P4_1P8X2P1]
U?#4  ICM-20948  [IC_IMU_TDK_InvenSense_0_IPC_A]
U?#5  NEO-M9N-00B  [IC_MODULE_UBLOX_NEOM9N00B]
U?#6  AP2114H-3.3TRG1  [IC_REG_SOT230P700X180-4N]

### Blocks framed on the sheet
IMU: C?#3-C?#9 U?#2-U?#4
GPS: BH? C?#10-C?#17 D?#1-D?#6 FB?#2 FB?#3 J?#2 J?#3 R?#3-R?#9 U?#5 U?#6

### Ports
AD0, INT1, SCL, SDA

### Nets
1V8: C?#4.2 C?#6.2 C?#7.2 C?#8.2 U?#2.A2(VOUT) U?#3.1(VCC(A)) U?#4.8(VDDIO) U?#4.13(VDD) U?#4.22(~{CS})
3V3: C?#9.2 C?#14.2 C?#15.2 D?#6.2(A) FB?#2.1 U?#2.A1(VIN) U?#2.B1(EN) U?#6.2(VOUT) U?#6.4(VOUT)
5V: C?#11.2 C?#12.2 C?#13.2 D?#1.1(K) U?#6.3(VIN)
GND: BH?.1(-) C?#3.1 C?#4.1 C?#5.2 C?#6.1 C?#7.1 C?#8.1 C?#9.1 C?#10.2 C?#11.1 C?#12.1 C?#13.1 C?#14.1 C?#15.1 C?#16.1 C?#17.1 D?#2.1(C) D?#3.1(K1) D?#4.1(K1) D?#5.1(K1) J?#2.A1_B12(GND) J?#2.B1_A12(GND) J?#2.SH1(SHIELD) J?#2.SH2(SHIELD) J?#2.SH3(SHIELD) J?#2.SH4(SHIELD) J?#3.2 J?#3.3 R?#5.1 R?#6.1 R?#7.1 U?#2.B2(GND) U?#3.6(GND) U?#4.11(FSYNC) U?#4.18(GND) U?#4.20(RESERVED) U?#5.10(GND_1) U?#5.12(GND_2) U?#5.13(GND_3) U?#5.24(GND_4) U?#6.1(GND)
VBUS_2: D?#1.2(A) D?#5.2(K2) J?#2.A4_B9(VBUS) J?#2.B4_A9(VBUS)
VGPS_3V3: C?#10.1 FB?#2.2 R?#3.2 R?#5.2 U?#5.7(V_USB) U?#5.23(VCC)
VMCU: C?#5.1 U?#3.11(VCC(B)) U?#3.12(OE)
AD0: U?#3.9(B2) ; port AD0
AD0_IMU: U?#3.4(A3) U?#4.9(SDO/AD0)
INT1: U?#3.10(B1) ; port INT1
INT1_IMU: U?#3.5(A4) U?#4.12(INT1)
PPS_GPS: R?#4.1 U?#5.3(TIMEPULSE)
REGOUT: C?#3.2 U?#4.10(REGOUT)
RESET_GPS: R?#3.1 U?#5.8(RESET_N)
RF_IN: FB?#3.2 J?#3.1 U?#5.11(RF_IN)
SCL: U?#3.8(B3) U?#5.19(SCL_/_SPI_SLK_) ; port SCL
SCL_IMU: U?#3.3(A2) U?#4.23(SCL/SCLK)
SDA: U?#3.7(B4) U?#5.18(SDA_/_SPI_CS_N) ; port SDA
SDA_IMU: U?#3.2(A1) U?#4.24(SDA/SDI)
USB_GPS_N: D?#3.2(K2) J?#2.A7(D-_A) J?#2.B7(D-_B) U?#5.5(USB_DM)
USB_GPS_P: D?#4.2(K2) J?#2.A6(D+_A) J?#2.B6(D+_B) U?#5.6(USB_DP)
V_BCKP: BH?.2(+) C?#16.2 R?#8.1 U?#5.22(V_BCKP)
VCC_RF: R?#9.2 U?#5.9(VCC_RF)
NetC?#17_2: C?#17.2 FB?#3.1 R?#9.1
NetD?#2_2: D?#2.2(A) R?#4.2
NetD?#6_1: D?#6.1(K) R?#8.2
NetJ?#2_A5: J?#2.A5(CC1_A) R?#7.2
NetJ?#2_B5: J?#2.B5(CC1_B) R?#6.2

Not connected (* = marked no-connect by the designer): J?#2 A8(SBU1)* B8(SBU2)*; U?#4 1(NC)* 2(NC)* 3(NC)* 4(NC)* 5(NC)* 6(NC)* 7(AUX_CL)* 14(NC)* 15(NC)* 16(NC)* 17(NC)* 19(RESERVED)* 21(AUX_DA)*; U?#5 1(SAFEBOOT_N)* 2(D_SEL)* 4(EXTINT)* 14(LNA_EN)* 15(RESERVED_1)* 16(RESERVED_2)* 17(RESERVED_3)* 20(TXD_/_SPI_MISO)* 21(RXD_/_SPI_MOSI)*

### Layout directives
differential pair; differential pair class Z90; net class Z90: USB_GPS_N, USB_GPS_P

### Notes on the sheet
- (near U?#4) IMU
- IMU signals traslate
- (near U?#2) LDO for IMU
- (near C?#10) GPS: u-Blox NEO-M9N
- USB - PORT for GPS (Only Debbuging)
- (near R?#4) I2C Mode
- State leds
- LDO for GPS
- (near J?#3) u.FL Antenna
- (near D?#6) Hot Start Battery
- PCB Des :
- Approv By :
- Project Title :
- Sheet Title :
- Date :
- PCB Version :
- Size :
- A3
- Page :
- PCB Revision :